# Altium project Control_Board_Model_C201.PrjPcb (part 1 of 8)
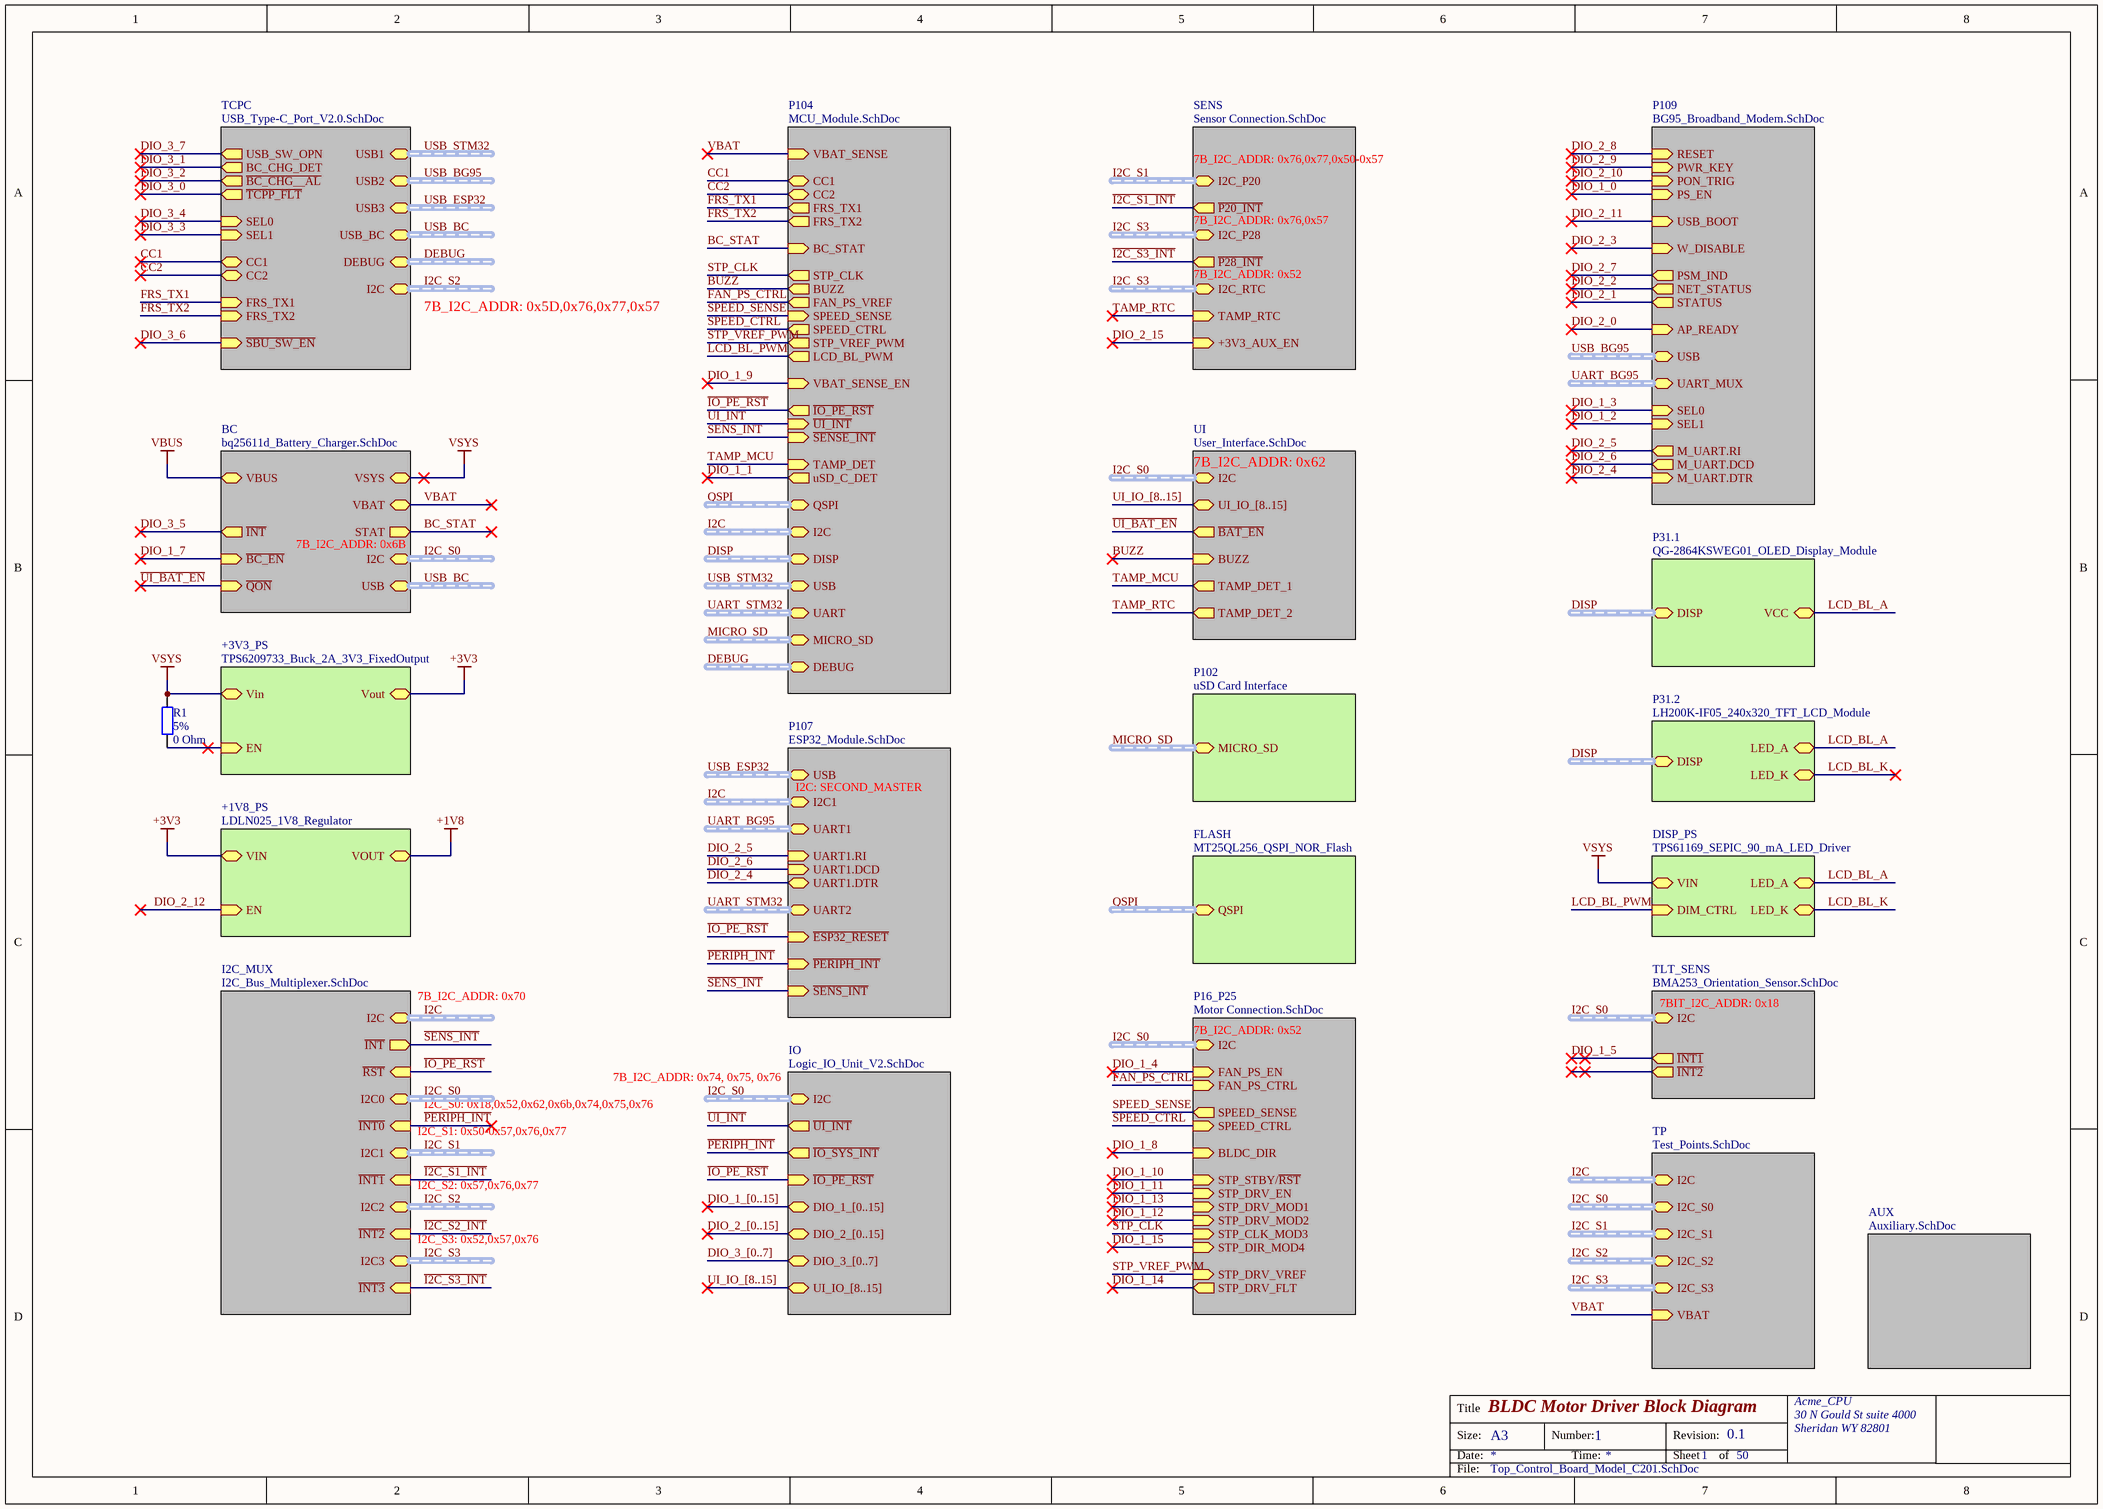
[diagram p0: Top_Control_Board_Model_C201.SchDoc]
_Title: Control_Board; _Revision: 0.1; _PCBNumber: 001; _PCBModel: C201; _HWEngineer: SGU; _DocumentDate: 20211204; _DateCode: 2020.30; _CompanyName: Acme_CPU; _BoardName: Control_Board; _ApprovedBy: PGU; _address2: Sheridan WY 82801; _address1: 30 N Gould St suite 4000
21 sheets, 279 parts. Net scope: hierarchical (ports join the sheet entries above them; power ports are global).
Board file: Control_Board_Model_C201_FFC_Sens_Conn.PcbDoc
Sheets:
  Top_Control_Board_Model_C201.SchDoc
    TCPC = USB_Type-C_Port_V2.0.SchDoc
    TP = Test_Points.SchDoc
    P104 = MCU_Module.SchDoc
      P01 = SWD_TagConnect.SchDoc
      RTC_XTAL = NX3215SA-32.768k_Crystall_Oscillator.SchDoc
      AN_IO = Analog_Signal_Conditioner_V2.SchDoc
    P16_P25 = Motor Connection.SchDoc
    SENS = Sensor Connection.SchDoc
    BC = bq25611d_Battery_Charger.SchDoc
    UI = User_Interface.SchDoc
    AUX = Auxiliary.SchDoc
    P107 = ESP32_Module.SchDoc
    P109 = BG95_Broadband_Modem.SchDoc
      BG95_MISC = BG95_Misc.SchDoc
      BG95_PWR = BG95_Power.SchDoc
      BG95_RF = BG95_RF.SchDoc
      BG95_VLT = BG95_VLT.SchDoc
    IO = Logic_IO_Unit_V2.SchDoc
    I2C_MUX = I2C_Bus_Multiplexer.SchDoc
    TLT_SENS = BMA253_Orientation_Sensor.SchDoc

## Sheet Top_Control_Board_Model_C201.SchDoc: BLDC Motor Driver Block Diagram
size A3; DocumentNumber: 1; SheetNumber: 1; SheetTotal: 50

### Parts
R1  Tolerance: 5%  Resistance: 0 Ohm  [R0402]  (hidden comment: RES SMD 0 OHM JUMPER 1/16W 0402)

### Sub-sheets
+1V8_PS = LDLN025_1V8_Regulator (file not in this document): EN (in), VIN, VOUT
+3V3_PS = TPS6209733_Buck_2A_3V3_FixedOutput (file not in this document): Vout, Vin, EN (in)
AUX = Auxiliary.SchDoc: no entries
BC = bq25611d_Battery_Charger.SchDoc: VSYS, VBUS, ~{QON} (in), USB (harness USB), I2C (harness I2C), ~{INT} (out), STAT (out), ~{BC_EN} (in), VBAT  | 7B_I2C_ADDR: 0x6B
DISP_PS = TPS61169_SEPIC_90_mA_LED_Driver (file not in this document): VIN, LED_K, DIM_CTRL (in), LED_A
FLASH = MT25QL256_QSPI_NOR_Flash (file not in this document): QSPI (harness QSPI)
I2C_MUX = I2C_Bus_Multiplexer.SchDoc: I2C0 (harness I2C), I2C1 (harness I2C), I2C2 (harness I2C), I2C3 (harness I2C), ~{INT0} (in), ~{INT1} (in), ~{INT2} (in), ~{INT3} (in), I2C (harness I2C), ~{INT} (out), ~{RST} (in)  | 7B_I2C_ADDR: 0x70; I2C_S0: 0x18,0x52,0x62,0x6b,0x74,0x75,0x76; I2C_S1: 0x50-0x57,0x76,0x77; I2C_S2: 0x57,0x76,0x77; I2C_S3: 0x52,0x57,0x76
IO = Logic_IO_Unit_V2.SchDoc: I2C (harness I2C), DIO_1_[0..15] (bidir), ~{IO_PE_RST} (in), DIO_2_[0..15] (bidir), DIO_3_[0..7] (bidir), UI_IO_[8..15] (bidir), ~{IO_SYS_INT} (out), ~{UI_INT} (out)  | 7B_I2C_ADDR: 0x74, 0x75, 0x76
P16_P25 = Motor Connection.SchDoc: SPEED_CTRL (in), SPEED_SENSE (out), FAN_PS_CTRL (in), BLDC_DIR (in), I2C (harness I2C), STP_STBY/~{RST} (in), STP_DRV_EN (in), STP_DRV_MOD1 (in), STP_DRV_MOD2 (in), STP_CLK_MOD3 (in), STP_DIR_MOD4 (in), STP_DRV_VREF (in), STP_DRV_FLT (out), FAN_PS_EN (in)  | 7B_I2C_ADDR: 0x52
P31.1 = QG-2864KSWEG01_OLED_Display_Module (file not in this document): DISP (harness DISP_SPI), VCC
P31.2 = LH200K-IF05_240x320_TFT_LCD_Module (file not in this document): DISP (harness DISP_SPI), LED_K, LED_A
P102 = uSD Card Interface (file not in this document): MICRO_SD (harness MICRO_SD)
P104 = MCU_Module.SchDoc: FAN_PS_VREF (out), SPEED_CTRL (out), SPEED_SENSE (in), CC2 (bidir), CC1 (bidir), I2C (harness I2C), BC_STAT (in), BUZZ (out), VBAT_SENSE (in), MICRO_SD (harness MICRO_SD), DISP (harness DISP_SPI), USB (harness USB), ~{IO_PE_RST} (out), STP_CLK (out), STP_VREF_PWM (out), LCD_BL_PWM (out), QSPI (harness QSPI), UART (harness UART), FRS_TX1 (out), FRS_TX2 (out), ~{UI_INT} (in), TAMP_DET (in), ~{SENSE_INT} (in), DEBUG (harness DEBUG), uSD_C_DET (out), VBAT_SENSE_EN (in)
P107 = ESP32_Module.SchDoc: ~{ESP32_RESET} (in), UART2 (harness UART), USB (harness USB), UART1 (harness UART), I2C1 (harness I2C), UART1.RI (in), UART1.DCD (in), UART1.DTR (bidir), ~{PERIPH_INT} (in), ~{SENS_INT} (in)  | I2C: SECOND_MASTER
P109 = BG95_Broadband_Modem.SchDoc: PWR_KEY (in), PON_TRIG (in), W_DISABLE (in), USB_BOOT (in), NET_STATUS (out), AP_READY (in), STATUS (out), PSM_IND (out), PS_EN (in), RESET (in), USB (harness USB), SEL1 (in), SEL0 (in), UART_MUX (harness UART), M_UART.RI (out), M_UART.DCD (out), M_UART.DTR (in)
SENS = Sensor Connection.SchDoc: ~{P20_INT} (out), I2C_P20 (harness I2C), I2C_P28 (harness I2C), ~{P28_INT} (out), +3V3_AUX_EN (in), I2C_RTC (harness I2C), TAMP_RTC (in)  | 7B_I2C_ADDR: 0x76,0x77,0x50-0x57; 7B_I2C_ADDR: 0x76,0x57; 7B_I2C_ADDR: 0x52
TCPC = USB_Type-C_Port_V2.0.SchDoc: CC1 (bidir), CC2 (bidir), USB1 (harness USB), USB2 (harness USB), SEL1 (in), SEL0 (in), BC_CHG_DET (out), USB_SW_OPN (out), ~{TCPP_FLT} (out), USB3 (harness USB), ~{BC_CHG__AL} (out), USB_BC (harness USB), FRS_TX1 (in), FRS_TX2 (in), I2C (harness I2C), ~{SBU_SW_EN} (in), DEBUG (harness DEBUG)  | 7B_I2C_ADDR: 0x5D,0x76,0x77,0x57
TLT_SENS = BMA253_Orientation_Sensor.SchDoc: ~{INT2} (out), ~{INT1} (out), I2C (harness I2C)  | 7BIT_I2C_ADDR: 0x18
TP = Test_Points.SchDoc: I2C (harness I2C), I2C_S0 (harness I2C), I2C_S1 (harness I2C), I2C_S2 (harness I2C), I2C_S3 (harness I2C), VBAT (in)
UI = User_Interface.SchDoc: ~{BAT_EN} (out), BUZZ (in), TAMP_DET_1 (out), UI_IO_[8..15] (bidir), TAMP_DET_2 (out), I2C (harness I2C)  | 7B_I2C_ADDR: 0x62

### Nets
+3V3: sheet +3V3_PS/Vout, sheet +1V8_PS/VIN
VSYS: R1.2 ; sheet BC/VSYS, sheet +3V3_PS/Vin, sheet DISP_PS/VIN
~{I2C_S1_INT}: sheet SENS/~{P20_INT}, sheet I2C_MUX/~{INT1}
~{I2C_S3_INT}: sheet SENS/~{P28_INT}, sheet I2C_MUX/~{INT3}
~{IO_PE_RST}: sheet P104/~{IO_PE_RST}, sheet P107/~{ESP32_RESET}, sheet IO/~{IO_PE_RST}, sheet I2C_MUX/~{RST}
~{PERIPH_INT}: sheet P107/~{PERIPH_INT}, sheet IO/~{IO_SYS_INT}, sheet I2C_MUX/~{INT0}  [project net ~{INT0}]
~{SENS_INT}: sheet P104/~{SENSE_INT}, sheet P107/~{SENS_INT}, sheet I2C_MUX/~{INT}
~{UI_BAT_EN}: sheet BC/~{QON}, sheet UI/~{BAT_EN}
~{UI_INT}: sheet P104/~{UI_INT}, sheet IO/~{UI_INT}  [project net ~{IO_SYS_INT}]
BC_STAT: sheet P104/BC_STAT, sheet BC/STAT
BUZZ: sheet P104/BUZZ, sheet UI/BUZZ
CC1: sheet TCPC/CC1, sheet P104/CC1
CC2: sheet TCPC/CC2, sheet P104/CC2
DIO_1_0: sheet P109/PS_EN
DIO_1_1: sheet P104/uSD_C_DET
DIO_1_4: sheet P16_P25/FAN_PS_EN
DIO_1_5: sheet TLT_SENS/~{INT1}
DIO_1_10: sheet P16_P25/STP_STBY/~{RST}
DIO_1_11: sheet P16_P25/STP_DRV_EN
DIO_1_12: sheet P16_P25/STP_DRV_MOD2
DIO_1_13: sheet P16_P25/STP_DRV_MOD1
DIO_1_14: sheet P16_P25/STP_DRV_FLT
DIO_1_15: sheet P16_P25/STP_DIR_MOD4
DIO_2_0: sheet P109/AP_READY  [project net B1_0]
DIO_2_1: sheet P109/STATUS  [project net B1_1]
DIO_2_2: sheet P109/NET_STATUS  [project net B1_2]
DIO_2_3: sheet P109/W_DISABLE  [project net B1_3]
DIO_2_4: sheet P107/UART1.DTR, sheet P109/M_UART.DTR  [project net B1_4]
DIO_2_5: sheet P107/UART1.RI, sheet P109/M_UART.RI  [project net B1_5]
DIO_2_6: sheet P107/UART1.DCD, sheet P109/M_UART.DCD  [project net B1_6]
DIO_2_7: sheet P109/PSM_IND  [project net B1_7]
DIO_2_12: sheet +1V8_PS/EN
DIO_2_15: sheet SENS/+3V3_AUX_EN  [project net +3V3_AUX_EN]
DIO_3_0: sheet TCPC/~{TCPP_FLT}
DIO_3_2: sheet TCPC/~{BC_CHG__AL}
DIO_3_7: sheet TCPC/USB_SW_OPN
FAN_PS_CTRL: sheet P104/FAN_PS_VREF, sheet P16_P25/FAN_PS_CTRL
FRS_TX1: sheet TCPC/FRS_TX1, sheet P104/FRS_TX1
FRS_TX2: sheet TCPC/FRS_TX2, sheet P104/FRS_TX2
LCD_BL_A: sheet P31.1/VCC, sheet DISP_PS/LED_A, sheet P31.2/LED_A
LCD_BL_K: sheet DISP_PS/LED_K, sheet P31.2/LED_K
LCD_BL_PWM: sheet P104/LCD_BL_PWM, sheet DISP_PS/DIM_CTRL
SPEED_CTRL: sheet P104/SPEED_CTRL, sheet P16_P25/SPEED_CTRL  [project net PA1]
SPEED_SENSE: sheet P104/SPEED_SENSE, sheet P16_P25/SPEED_SENSE  [project net PA15]
STP_CLK: sheet P104/STP_CLK, sheet P16_P25/STP_CLK_MOD3  [project net PB9]
STP_VREF_PWM: sheet P104/STP_VREF_PWM, sheet P16_P25/STP_DRV_VREF  [project net PC7]
TAMP_MCU: sheet P104/TAMP_DET, sheet UI/TAMP_DET_1  [project net PC13]
TAMP_RTC: sheet SENS/TAMP_RTC, sheet UI/TAMP_DET_2
VBAT: sheet TP/VBAT, sheet P104/VBAT_SENSE, sheet BC/VBAT
NetR1_1: R1.1 ; sheet +3V3_PS/EN

### Buses and harness runs
bus DIO_1_[0..15] = sheet IO/DIO_1_[0..15]
bus DIO_2_[0..15] = sheet IO/DIO_2_[0..15]
bus DIO_3_[0..7] = sheet IO/DIO_3_[0..7]
bus UI_IO_[8..15] = sheet IO/UI_IO_[8..15]
bus UI_IO_[8..15] = sheet UI/UI_IO_[8..15]
harness DEBUG = sheet P104/DEBUG
harness DEBUG = sheet TCPC/DEBUG
harness DISP = sheet P31.1/DISP
harness DISP = sheet P31.2/DISP
harness DISP = sheet P104/DISP
harness I2C = sheet I2C_MUX/I2C
harness I2C = sheet P104/I2C
harness I2C = sheet P107/I2C1
harness I2C = sheet TP/I2C
harness I2C_S0 = sheet BC/I2C
harness I2C_S0 = sheet I2C_MUX/I2C0
harness I2C_S0 = sheet IO/I2C
harness I2C_S0 = sheet P16_P25/I2C
harness I2C_S0 = sheet TLT_SENS/I2C
harness I2C_S0 = sheet TP/I2C_S0
harness I2C_S0 = sheet UI/I2C
harness I2C_S1 = sheet I2C_MUX/I2C1
harness I2C_S1 = sheet SENS/I2C_P20
harness I2C_S1 = sheet TP/I2C_S1
harness I2C_S2 = sheet I2C_MUX/I2C2
harness I2C_S2 = sheet TCPC/I2C
harness I2C_S2 = sheet TP/I2C_S2
harness I2C_S3 = sheet I2C_MUX/I2C3
harness I2C_S3 = sheet SENS/I2C_P28
harness I2C_S3 = sheet SENS/I2C_RTC
harness I2C_S3 = sheet TP/I2C_S3
harness MICRO_SD = sheet P102/MICRO_SD
harness MICRO_SD = sheet P104/MICRO_SD
harness QSPI = sheet FLASH/QSPI
harness QSPI = sheet P104/QSPI
harness UART_BG95 = sheet P107/UART1
harness UART_BG95 = sheet P109/UART_MUX
harness UART_STM32 = sheet P104/UART
harness UART_STM32 = sheet P107/UART2
harness USB_BC = sheet BC/USB
harness USB_BC = sheet TCPC/USB_BC
harness USB_BG95 = sheet P109/USB
harness USB_BG95 = sheet TCPC/USB2
harness USB_ESP32 = sheet P107/USB
harness USB_ESP32 = sheet TCPC/USB3
harness USB_STM32 = sheet P104/USB
harness USB_STM32 = sheet TCPC/USB1

### Notes on the sheet
- Title
- Size:
- Date:
- A3
- Number:
- Time:
- Revision:
- Sheet
- of
- File:

### Library data of the parts
R1 = RES SMD 0 OHM JUMPER 1/16W 0402: 0 Ohms Jumper 0.063W, 1/16W Chip Resistor 0402 (1005 Metric) Moisture Resistant Thick Film; Manufacturer: Yageo; Manufacturer Part Number: RC0402JR-070RL; Power Rating: 62.5mW; Voltage Rating: 50V; Max Power Dissipation: 63mW; Temperature Coefficient: 200ppm/°C; Supplier 1: Digi-Key; Stock 1: 46057148; Pricing 1: 1=0.1, 10=0.013, 25=0.0092, 50=0.0072, 100=0.0053, 250=0.004, 500=0.0032, 1000=0.0024, 5000=0.0017 (USD); Contact Plating: Tin,Matte; Case Code (Metric): 1005; Case Code (Imperial): 0402; Min Operating Temperature: -55°C; Max Operating Temperature: 155°C; Packaging: Tape and Reel; Composition: Thick Film; Package Quantity: 1; Number of Terminations: 2; Termination: SMD/SMT; Military Standard: Not; Features: Moisture Resistant; Length: 1mm; Height: 0.016inch; Width: 0.02inch; Depth: 0.5mm; Radiation Hardening: No; REACH SVHC: Unknown; Lead Free: Lead Free; ComponentLink1URL: http://www.yageo.com/documents/recent/PYu-RC_Group_51_RoHS_L_10.pdf?src-supplier=Digi-Key; ComponentLink1Description: http://www.yageo.com/documents/recent/PYu-RC_Group_51_RoHS_L_10.pdf?src-supplier=Digi-Key; ComponentLink2URL: http://www.yageo.com/documents/recent/PYu-RC0402_51_RoHS_L_6.pdf?src-supplier=Avnet+Europe; ComponentLink2Description: http://www.yageo.com/documents/recent/PYu-RC0402_51_RoHS_L_6.pdf?src-supplier=Avnet+Europe; ComponentLink3URL: http://www.farnell.com/datasheets/1018594.pdf?src-supplier=Element14; ComponentLink3Description: http://www.farnell.com/datasheets/1018594.pdf?src-supplier=Element14; ComponentLink4URL: https://www.verical.com/server-webapp/html/getDatasheet?partID=326379&src-supplier=Verical; ComponentLink4Description: https://www.verical.com/server-webapp/html/getDatasheet?partID=326379&src-supplier=Verical; ComponentLink5URL: http://www.farnell.com/datasheets/2167052.pdf?src-supplier=Element14; ComponentLink5Description: http://www.farnell.com/datasheets/2167052.pdf?src-supplier=Element14; Supplier Part Number 1: 311-0.0JRCT-ND; Case/Package: 0402; ClassName: +3V3_PS; Mount: Surface Mount

## Sheet USB_Type-C_Port_V2.0.SchDoc: USB Type-C PD Port Controller
size A4; DocumentNumber: 2; SheetNumber: 2; SheetTotal: 50
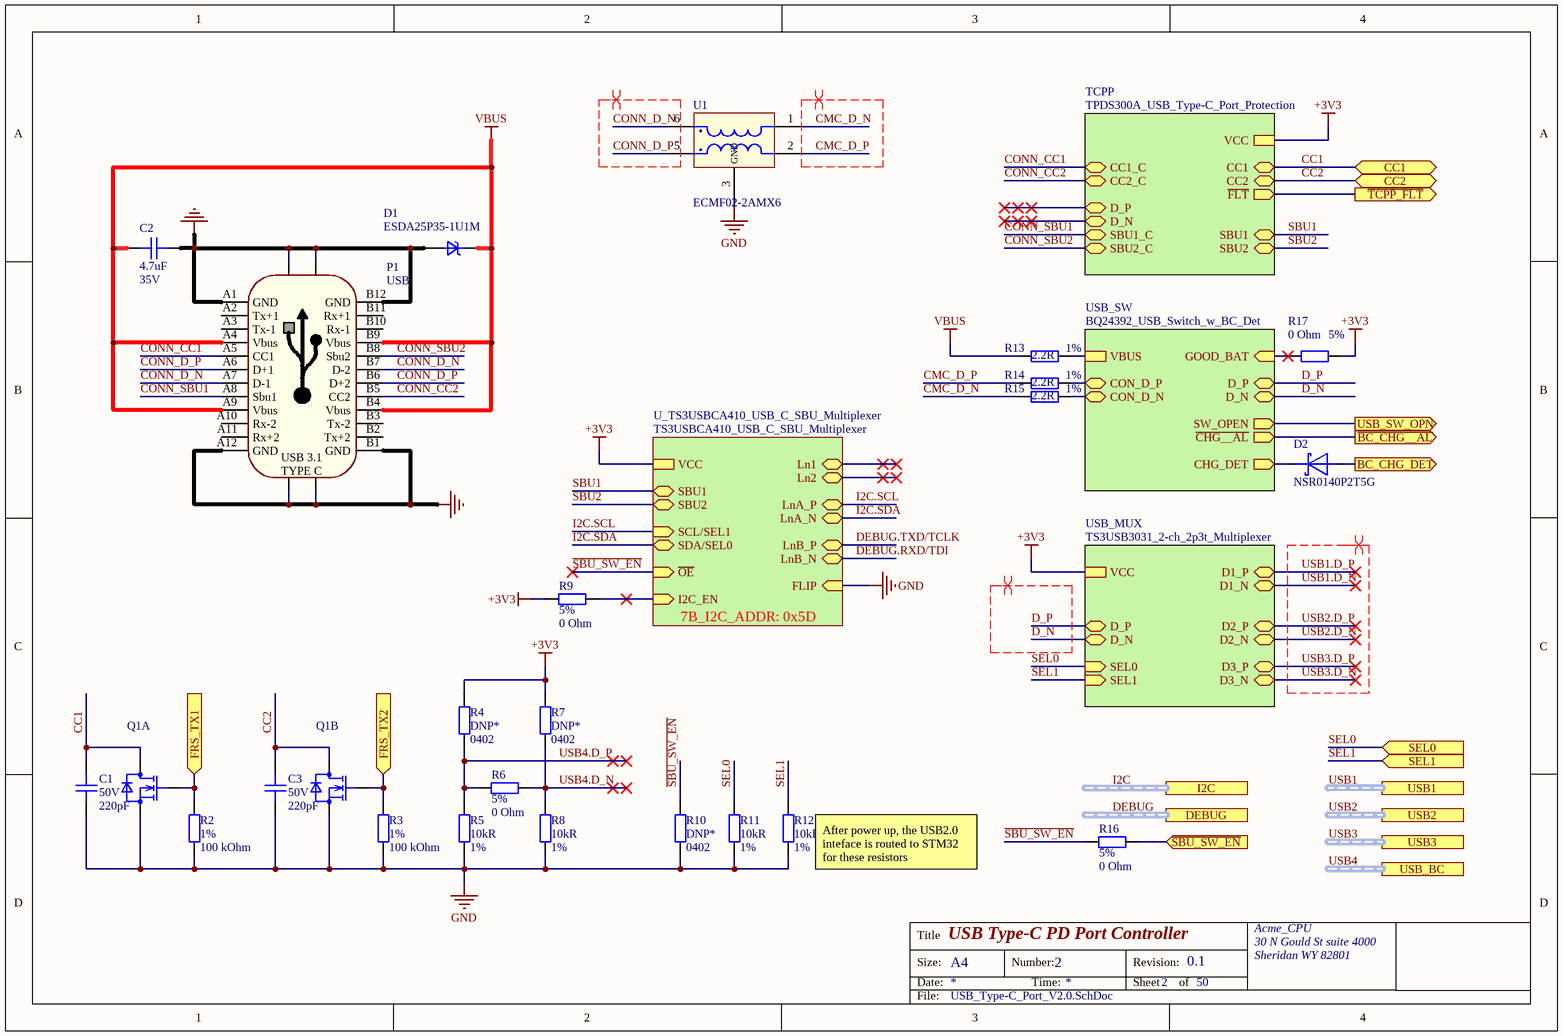
[diagram p1: USB_Type-C_Port_V2.0.SchDoc]

### Parts
C1  Voltage Rating: 50V  Capacitance: 220pF  [C0402]  (hidden comment: CAP CER 220PF 50V X7R 0402)
C2  Capacitance: 4.7uF  Voltage Rating: 35V  [C0805]  (hidden comment: CAP CER 4.7UF 35V X7R 0805)
C3  Voltage Rating: 50V  Capacitance: 220pF  [C0402]  (hidden comment: CAP CER 220PF 50V X7R 0402)
D1  ESDA25P35-1U1M  [ST_QFN_1610]
D2  NSR0140P2T5G  [SODFL100X40-2N]
P1  USB  [MOLEX_2012670005]
Q1  DMN32D2LV-7  [SON_400UV-7_DIO]  (value not drawn)  (parts A,B of 2)
R2  Tolerance: 1%  Resistance: 100 kOhm  [R0402]  (hidden comment: RES SMD 100K OHM 1% 1/16W 0402)
R3  Tolerance: 1%  Resistance: 100 kOhm  [R0402]  (hidden comment: RES SMD 100K OHM 1% 1/16W 0402)
R4  DNP*  Case/Package: 0402  [R0402]  (no BOM)
R5  Resistance: 10kR  Tolerance: 1%  [R0402]  (hidden comment: RES SMD 10K OHM 1% 1/16W 0402)
R6  Tolerance: 5%  Resistance: 0 Ohm  [R0402]  (hidden comment: RES SMD 0 OHM JUMPER 1/16W 0402)
R7  DNP*  Case/Package: 0402  [R0402]  (no BOM)
R8  Resistance: 10kR  Tolerance: 1%  [R0402]  (hidden comment: RES SMD 10K OHM 1% 1/16W 0402)
R9  Tolerance: 5%  Resistance: 0 Ohm  [R0402]  (hidden comment: RES SMD 0 OHM JUMPER 1/16W 0402)
R10  DNP*  Case/Package: 0402  [R0402]  (no BOM)
R11  Resistance: 10kR  Tolerance: 1%  [R0402]  (hidden comment: RES SMD 10K OHM 1% 1/16W 0402)
R12  Resistance: 10kR  Tolerance: 1%  [R0402]  (hidden comment: RES SMD 10K OHM 1% 1/16W 0402)
R13  Tolerance: 1%  Resistance: 2.2R  [R0402]  (hidden comment: RES SMD 2.2 OHM 1% 1/16W 0402)
R14  Tolerance: 1%  Resistance: 2.2R  [R0402]  (hidden comment: RES SMD 2.2 OHM 1% 1/16W 0402)
R15  Tolerance: 1%  Resistance: 2.2R  [R0402]  (hidden comment: RES SMD 2.2 OHM 1% 1/16W 0402)
R16  Tolerance: 5%  Resistance: 0 Ohm  [R0402]  (hidden comment: RES SMD 0 OHM JUMPER 1/16W 0402)
R17  Tolerance: 5%  Resistance: 0 Ohm  [R0402]  (hidden comment: RES SMD 0 OHM JUMPER 1/16W 0402)
U1  ECMF02-2AMX6  [QFN-6L]

### Sub-sheets
TCPP = TPDS300A_USB_Type-C_Port_Protection (file not in this document): ~{FLT} (out), VCC, CC1 (bidir), CC2 (bidir), CC1_C (bidir), CC2_C (bidir), SBU1_C (bidir), SBU2_C (bidir), SBU1 (bidir), SBU2 (bidir), D_P (bidir), D_N (bidir)
U_TS3USBCA410_USB_C_SBU_Multiplexer = TS3USBCA410_USB_C_SBU_Multiplexer (file not in this document): LnB_P (bidir), LnB_N (bidir), LnA_P (bidir), VCC, Ln1 (bidir), Ln2 (bidir), SBU1 (bidir), SBU2 (bidir), LnA_N (bidir), SCL/SEL1 (in), I2C_EN (in), FLIP (in), SDA/SEL0 (bidir), ~{OE} (in)  | 7B_I2C_ADDR: 0x5D
USB_MUX = TS3USB3031_2-ch_2p3t_Multiplexer (file not in this document): VCC, D_P (bidir), D_N (bidir), D1_N (bidir), D1_P (bidir), D2_P (bidir), D2_N (bidir), D3_N (bidir), D3_P (bidir), SEL0 (in), SEL1 (in)
USB_SW = BQ24392_USB_Switch_w_BC_Det (file not in this document): CHG_DET (out), D_N (bidir), D_P (bidir), GOOD_BAT (in), CON_D_N (bidir), CON_D_P (bidir), SW_OPEN (out), VBUS, ~{CHG__AL} (out)

### Ports
BC_CHG_DET (out), CC1 (bidir), CC2 (bidir), DEBUG (harness DEBUG), FRS_TX1 (in), FRS_TX2 (in), I2C (harness I2C), SEL0 (in), SEL1 (in), USB1 (harness USB), USB2 (harness USB), USB3 (harness USB), USB_BC (harness USB), USB_SW_OPN (out), ~{BC_CHG__AL} (out), ~{SBU_SW_EN} (in), ~{TCPP_FLT} (out)

### Nets
+3V3: R4.1 R7.1 R9.1 R17.2 ; sheet USB_MUX/VCC, sheet TCPP/VCC, sheet U_TS3USBCA410_USB_C_SBU_Multiplexer/VCC
GND: C1.1 C2.2 C3.1 D1.2(A) P1.A1(GND) P1.A12(GND) P1.B1(GND) P1.B12(GND) P1.S1 P1.S2 P1.S3 P1.S4 Q1.1(S) Q1.4(S) R2.1 R3.1 R5.2 R8.2 R10.2 R11.2 R12.2 U1.3(GND) ; sheet U_TS3USBCA410_USB_C_SBU_Multiplexer/FLIP
VBUS: C2.1 D1.1(K) P1.A4(Vbus) P1.A9(Vbus) P1.B4(Vbus) P1.B9(Vbus) R13.1
~{SBU_SW_EN}: R10.1 R16.2 ; sheet U_TS3USBCA410_USB_C_SBU_Multiplexer/~{OE}
CC1: C1.2 Q1.6(D) ; port CC1, sheet TCPP/CC1
CC2: C3.2 Q1.3(D) ; port CC2, sheet TCPP/CC2
CMC_D_N: R15.1 U1.1(INP1)
CMC_D_P: R14.1 U1.2(INP2)
CONN_CC1: P1.A5(CC1) ; sheet TCPP/CC1_C
CONN_CC2: P1.B5(CC2) ; sheet TCPP/CC2_C
CONN_D_N: P1.A7(D-1) P1.B7(D-2) U1.6(OUT1)
CONN_D_P: P1.A6(D+1) P1.B6(D+2) U1.5(OUT2)
CONN_SBU1: P1.A8(Sbu1) ; sheet TCPP/SBU1_C
CONN_SBU2: P1.B8(Sbu2) ; sheet TCPP/SBU2_C
D_N: sheet USB_MUX/D_N, sheet USB_SW/D_N
D_P: sheet USB_MUX/D_P, sheet USB_SW/D_P
DEBUG.RXD/TDI: sheet U_TS3USBCA410_USB_C_SBU_Multiplexer/LnB_N
DEBUG.TXD/TCLK: sheet U_TS3USBCA410_USB_C_SBU_Multiplexer/LnB_P
DIO_3_0: port ~{TCPP_FLT}, sheet TCPP/~{FLT}
DIO_3_1: D2.2(A) ; port BC_CHG_DET
DIO_3_2: port ~{BC_CHG__AL}, sheet USB_SW/~{CHG__AL}
DIO_3_6: R16.1 ; port ~{SBU_SW_EN}
DIO_3_7: port USB_SW_OPN, sheet USB_SW/SW_OPEN
FRS_TX1: Q1.2(G) R2.2 ; port FRS_TX1
FRS_TX2: Q1.5(G) R3.2 ; port FRS_TX2
I2C.SCL: sheet U_TS3USBCA410_USB_C_SBU_Multiplexer/LnA_P, sheet U_TS3USBCA410_USB_C_SBU_Multiplexer/SCL/SEL1
I2C.SDA: sheet U_TS3USBCA410_USB_C_SBU_Multiplexer/LnA_N, sheet U_TS3USBCA410_USB_C_SBU_Multiplexer/SDA/SEL0
SBU1: sheet TCPP/SBU1, sheet U_TS3USBCA410_USB_C_SBU_Multiplexer/SBU1
SBU2: sheet TCPP/SBU2, sheet U_TS3USBCA410_USB_C_SBU_Multiplexer/SBU2
SEL0: R11.1 ; port SEL0, sheet USB_MUX/SEL0  [project net DIO_3_4]
SEL1: R12.1 ; port SEL1, sheet USB_MUX/SEL1  [project net DIO_3_3]
USB1.D_N: sheet USB_MUX/D1_N
USB1.D_P: sheet USB_MUX/D1_P
USB2.D_N: sheet USB_MUX/D2_N
USB2.D_P: sheet USB_MUX/D2_P
USB3.D_N: sheet USB_MUX/D3_N
USB3.D_P: sheet USB_MUX/D3_P
USB4.D_N: R6.2 R7.2 R8.1
USB4.D_P: R4.2 R5.1 R6.1
NetD2_1: D2.1(K) ; sheet USB_SW/CHG_DET
NetR9_2: R9.2 ; sheet U_TS3USBCA410_USB_C_SBU_Multiplexer/I2C_EN
NetR13_2: R13.2 ; sheet USB_SW/VBUS
NetR14_2: R14.2 ; sheet USB_SW/CON_D_P
NetR15_2: R15.2 ; sheet USB_SW/CON_D_N
NetR17_1: R17.1 ; sheet USB_SW/GOOD_BAT

Not connected (* = marked no-connect by the designer): P1 A2(Tx+1) A3(Tx-1) A10(Rx-2) A11(Rx+2) B2(Tx+2) B3(Tx-2) B10(Rx-1) B11(Rx+1); U1 4(NC)

### Buses and harness runs
harness DEBUG = port DEBUG
harness I2C = port I2C
harness USB1 = port USB1
harness USB2 = port USB2
harness USB3 = port USB3
harness USB4 = port USB_BC

### Layout directives
differential pair: CMC_D_N, CMC_D_P, CONN_D_N, CONN_D_P, D_N, D_P, USB1.D_N, USB1.D_P, USB2.D_N, USB2.D_P, USB3.D_N, USB3.D_P

### Notes on the sheet
- (near R12) After power up, the USB2.0 inteface is routed to STM32 for these resistors
- Title
- Size:
- Date:
- A4
- Number:
- Time:
- Revision:
- Sheet
- of
- File:
- (in symbol CONN 2012670005 RCP USB3.1 TYPEC 24P SMD RA) USB 3.1; TYPE C

### Library data of the parts
C1 C3 = CAP CER 220PF 50V X7R 0402: 220pF ±10% 50V Ceramic Capacitor X7R 0402 (1005 Metric); Manufacturer: Yageo; Manufacturer Part Number: CC0402KRX7R9BB221; Insulation Resistance: 100GR; Supplier 1: Digi-Key; Stock 1: 91221; Pricing 1: 1=0.1, 10=0.026, 50=0.014, 100=0.0114, 500=0.0081, 1000=0.0064, 2500=0.0058, 5000=0.0053 (USD); Mount: Surface Mount; Case/Package: 0402; Weight: 2.3E-05oz; Case Code (Metric): 1005; Case Code (Imperial): 0402; Min Operating Temperature: -55°C; Max Operating Temperature: 125°C; Tolerance: 10%; Packaging: Tape and Reel; Package Quantity: 1; Voltage Rating (DC): 50V; Dielectric: X7R; Termination: SMD/SMT; Composition: Ceramic; Length: 1mm; Height: 0.5mm; Width: 0.02inch; Thickness: 0.022inch; Depth: 0.5mm; REACH SVHC: No SVHC; Lead Free: Lead Free; ComponentLink1URL: http://www.yageo.com/documents/recent/UPY-GPHC_X7R_6.3V-to-50V_18.pdf?src-supplier=Digi-Key; ComponentLink1Description: http://www.yageo.com/documents/recent/UPY-GPHC_X7R_6.3V-to-50V_18.pdf?src-supplier=Digi-Key; ComponentLink2URL: http://www.farnell.com/datasheets/2167236.pdf?src-supplier=Farnell; ComponentLink2Description: http://www.farnell.com/datasheets/2167236.pdf?src-supplier=Farnell; ComponentLink3URL: http://www.yageo.com/documents/recent/UPY-GPHC_X7R_6.3V-to-50V_8.pdf?src-supplier=Avnet; ComponentLink3Description: http://www.yageo.com/documents/recent/UPY-GPHC_X7R_6.3V-to-50V_8.pdf?src-supplier=Avnet; ComponentLink4URL: http://www.farnell.com/datasheets/1489800.pdf?src-supplier=Element14; ComponentLink4Description: http://www.farnell.com/datasheets/1489800.pdf?src-supplier=Element14; ComponentLink5URL: http://www.mouser.com/ds/2/447/Yageo_UPY-GP_NP0_16V-to-50V_9-358835.pdf?src-supplier=Mouser; ComponentLink5Description: http://www.mouser.com/ds/2/447/Yageo_UPY-GP_NP0_16V-to-50V_9-358835.pdf?src-supplier=Mouser; Supplier Part Number 1: 311-1035-1-ND; Number of Pins: 2; Dielectric Material: Ceramic; Radiation Hardening: No; Halogen Free: Halogen Free; ComponentLink6URL: https://www.verical.com/server-webapp/html/getDatasheet?partID=403476&src-supplier=Verical; ComponentLink6Description: https://www.verical.com/server-webapp/html/getDatasheet?partID=403476&src-supplier=Verical; ComponentLink7URL: http://www.yageo.com/documents/recent/UPY-GPHC_X7R_6.3V-to-50V_8.pdf?src-supplier=Avnet+Europe; ComponentLink7Description: http://www.yageo.com/documents/recent/UPY-GPHC_X7R_6.3V-to-50V_8.pdf?src-supplier=Avnet+Europe; ClassName: TCPP
C2 = CAP CER 4.7UF 35V X7R 0805: Manufacturer: TDK; Manufacturer Part Number: C2012X7R1V475K125AC; Dielectric Material: Ceramic; Tolerance: 10%; Supplier 1: Digi-Key; Stock 1: 109602; Pricing 1: 1=0.73, 10=0.519, 50=0.3752, 100=0.3416, 500=0.253, 1000=0.2151 (USD); Mount: Surface Mount; Case/Package: 0805; Weight: 0.000194oz; Case Code (Metric): 2012; Case Code (Imperial): 0805; Min Operating Temperature: -55°C; Max Operating Temperature: 125°C; Packaging: Tape and Reel; Package Quantity: 2000; Dielectric: X7R; Termination: SMD/SMT; Voltage Rating (DC): 35V; Length: 2mm; Height: 1.25mm; Width: 0.049inch; Thickness: 0.057inch; Depth: 1.25mm; Radiation Hardening: No; REACH SVHC: No SVHC; Lead Free: Lead Free; ComponentLink1URL: http://www.farnell.com/datasheets/2792994.pdf?src-supplier=Element14; ComponentLink1Description: http://www.farnell.com/datasheets/2792994.pdf?src-supplier=Element14; ComponentLink2URL: https://product.tdk.com/info/en/catalog/datasheets/mlcc_commercial_general_en.pdf?src-supplier=Digi-Key; ComponentLink2Description: https://product.tdk.com/info/en/catalog/datasheets/mlcc_commercial_general_en.pdf?src-supplier=Digi-Key; ComponentLink3URL: https://product.tdk.com/info/en/catalog/spec/mlccspec_commercial_general_midvoltage_en.pdf?src-supplier=Digi-Key; ComponentLink3Description: https://product.tdk.com/info/en/catalog/spec/mlccspec_commercial_general_midvoltage_en.pdf?src-supplier=Digi-Key; Supplier Part Number 1: 445-7555-1-ND
D1 = TVS DIODE ESDA25P35-1U1M 22V 41V 1610: 41V Clamp 35A (8/20µs) Ipp Tvs Diode Surface Mount 1610; Manufacturer: STMicroelectronics; Number of Unidirectional Channels: 1; Reverse Standoff Voltage: 22V; Min Breakdown Voltage: 23.3V; Peak Pulse Power: 1.4kW; Power Line Protection: No; Supplier 1: Digi-Key; Manufacturer Part Number: ESDA25P35-1U1M; Stock 1: 12413; Pricing 1: 1=0.45, 10=0.362, 25=0.3312, 100=0.2079, 250=0.2056, 500=0.1925, 1000=0.1309, 2500=0.1255 (USD); Mount: Surface Mount; Case/Package: 1610; Number of Pins: 2; Min Operating Temperature: -55°C; Max Operating Temperature: 150°C; Composition: Zener; Packaging: Tape and Reel; Clamping Voltage: 41V; Peak Pulse Current: 35A; ComponentLink1URL: http://www.st.com/content/ccc/resource/technical/document/datasheet/group3/e4/43/53/b9/4e/8a/40/bb/DM00312034/files/DM00312034.pdf/jcr:content/translations/en.DM00312034.pdf?src-supplier=Digi-Key; ComponentLink1Description: http://www.st.com/content/ccc/resource/technical/document/datasheet/group3/e4/43/53/b9/4e/8a/40/bb/DM00312034/files/DM00312034.pdf/jcr:content/translations/en.DM00312034.pdf?src-supplier=Digi-Key; ComponentLink2URL: http://www.farnell.com/datasheets/2236209.pdf?src-supplier=Farnell; ComponentLink2Description: http://www.farnell.com/datasheets/2236209.pdf?src-supplier=Farnell; ComponentLink3URL: http://www.farnell.com/datasheets/2236209.pdf?src-supplier=Element14; ComponentLink3Description: http://www.farnell.com/datasheets/2236209.pdf?src-supplier=Element14; ComponentLink4URL: http://www.farnell.com/datasheets/2236209.pdf?src-supplier=Newark; ComponentLink4Description: http://www.farnell.com/datasheets/2236209.pdf?src-supplier=Newark; Supplier Part Number 1: 497-16913-1-ND
D2 = DIODE SCHOTTKY 30V 70MA SOD923: Diode Schottky 30V 70mA (DC) Surface Mount SOD-923; Manufacturer: ON Semiconductor; Forward Voltage: 350mV; Max Surge Current: 500mA; Max Power Dissipation: 100mW; Max Reverse Leakage Current: 500nA; Element Configuration: Single; Supplier 1: Digi-Key; Manufacturer Part Number: NSR0140P2T5G; Stock 1: 28802; Pricing 1: 1=0.36, 10=0.27, 25=0.2368, 100=0.1284, 500=0.1048, 1000=0.0777, 2500=0.0683 (USD); Case/Package: SOD-923-2; Number of Pins: 2; Contact Plating: Tin,Matte; Min Operating Temperature: -55°C; Max Operating Temperature: 125°C; Forward Current: 70mA; Package Quantity: 1; Packaging: Tape and Reel; Average Rectified Current: 70mA; Max Repetitive Reverse Voltage (Vrrm): 30V; Peak Reverse Current: 500nA; Power Dissipation: 100mW; Peak Non-Repetitive Surge Current: 500mA; Max Forward Surge Current (Ifsm): 500mA; Termination: SMD/SMT; Max Reverse Voltage (DC): 30V; Length: 0.85mm; Height: 0.43mm; Width: 0.65mm; Radiation Hardening: No; REACH SVHC: No SVHC; Lead Free: Lead Free; ComponentLink1URL: http://www.onsemi.com/pub_link/Collateral/NSR0140P2-D.PDF?src-supplier=Future+Electronics; ComponentLink1Description: http://www.onsemi.com/pub_link/Collateral/NSR0140P2-D.PDF?src-supplier=Future+Electronics; ComponentLink2URL: http://www.farnell.com/datasheets/2353885.pdf?src-supplier=Newark; ComponentLink2Description: http://www.farnell.com/datasheets/2353885.pdf?src-supplier=Newark; ComponentLink3URL: http://www.farnell.com/datasheets/86281.pdf?src-supplier=Element14; ComponentLink3Description: http://www.farnell.com/datasheets/86281.pdf?src-supplier=Element14; ComponentLink4URL: http://www.onsemi.com/pub/Collateral/NSR0140P2-D.PDF?src-supplier=Avnet; ComponentLink4Description: http://www.onsemi.com/pub/Collateral/NSR0140P2-D.PDF?src-supplier=Avnet; ComponentLink5URL: http://www.onsemi.com/pub/Collateral/NSR0140P2-D.PDF?src-supplier=Digi-Key; ComponentLink5Description: http://www.onsemi.com/pub/Collateral/NSR0140P2-D.PDF?src-supplier=Digi-Key; ComponentLink6URL: http://www.mouser.com/ds/2/308/NSR0140P2-D-115172.pdf?src-supplier=Mouser; ComponentLink6Description: http://www.mouser.com/ds/2/308/NSR0140P2-D-115172.pdf?src-supplier=Mouser; Supplier Part Number 1: NSR0140P2T5GOSCT-ND; ClassName: USB_SW; Mount: Surface Mount
P1 = CONN 2012670005 RCP USB3.1 TYPEC 24P SMD RA: USB-C (USB TYPE-C) USB 3.2 Gen 2 (USB 3.1 Gen 2, Superspeed + (USB 3.1)) Receptacle Connector 24 Position Surface Mount, Right Angle; Through Hole; Manufacturer: Molex; Manufacturer Part Number: 201267-0005; Number of Contacts: 24; Number of Ports: 1; Current Rating: 5A; Voltage Rating: 30V; Mating Cycles: 20000; Shielding: Shielded; Supplier 1: Digi-Key; Stock 1: 2580; Pricing 1: 1=2.34, 10=1.997, 100=1.6496 (USD); Mount: Surface Mount,Through Hole; Packaging: Tape and Reel; Connector Type: USB; Gender: Receptacle; ComponentLink1URL: https://www.molex.com/pdm_docs/sd/2012670005_sd.pdf?src-supplier=Digi-Key; ComponentLink1Description: https://www.molex.com/pdm_docs/sd/2012670005_sd.pdf?src-supplier=Digi-Key; ComponentLink2URL: http://www.farnell.com/datasheets/2722545.pdf?src-supplier=Element14; ComponentLink2Description: http://www.farnell.com/datasheets/2722545.pdf?src-supplier=Element14; Supplier Part Number 1: WM17992CT-ND; Contact Plating: Gold; Insulation Color: Black; Min Operating Temperature: -40°C; Max Operating Temperature: 105°C; Termination: Solder; Flammability Rating: UL94 V-0; ComponentLink3URL: http://www.farnell.com/datasheets/2722545.pdf?src-supplier=Newark; ComponentLink3Description: http://www.farnell.com/datasheets/2722545.pdf?src-supplier=Newark; ComponentLink4URL: https://www.molex.com/pdm_docs/pk/2012670005-PK1.pdf?src-supplier=Digi-Key; ComponentLink4Description: https://www.molex.com/pdm_docs/pk/2012670005-PK1.pdf?src-supplier=Digi-Key; ComponentLink5URL: http://www.farnell.com/datasheets/2722545.pdf?src-supplier=Farnell; ComponentLink5Description: http://www.farnell.com/datasheets/2722545.pdf?src-supplier=Farnell
Q1 = ARRAY MOSFET 2N-CH 30V 0.4A SOT-563: Mosfet Array 2 N-Channel (Dual) 30V 400mA 400mW Surface Mount SOT-563; Manufacturer: Diodes; Gate to Source Voltage (Vgs): 10V; Rds On Max: 1.2R; Input Capacitance: 39pF; Number of Channels: 2; Supplier 1: Digi-Key; Manufacturer Part Number: DMN32D2LV-7; Stock 1: 141366; Pricing 1: 1=0.39, 10=0.338, 25=0.3152, 100=0.234, 500=0.1827, 1000=0.1485 (USD); Mount: Surface Mount; Min Operating Temperature: -55°C; Max Operating Temperature: 150°C; Continuous Drain Current (ID): 400mA; Package Quantity: 3000; Packaging: Tape and Reel; Drain to Source Voltage (Vdss): 30V; Max Power Dissipation: 400mW; Drain to Source Breakdown Voltage: 30V; Drain to Source Resistance: 1.2R; Element Configuration: Dual; FET Type: 2 N-Channel; Length: 1.6mm; Height: 0.6mm; Width: 1.2mm; Radiation Hardening: No; REACH SVHC: No SVHC; ComponentLink1URL: https://www.diodes.com/assets/Datasheets/ds31121.pdf?src-supplier=Digi-Key; ComponentLink1Description: https://www.diodes.com/assets/Datasheets/ds31121.pdf?src-supplier=Digi-Key; ComponentLink2URL: http://www.mouser.com/ds/2/115/ds31121-89496.pdf?src-supplier=Mouser; ComponentLink2Description: http://www.mouser.com/ds/2/115/ds31121-89496.pdf?src-supplier=Mouser; ComponentLink3URL: http://www.diodes.com///datasheets/ds31121.pdf?src-supplier=Avnet; ComponentLink3Description: http://www.diodes.com///datasheets/ds31121.pdf?src-supplier=Avnet; Supplier Part Number 1: DMN32D2LV-7DICT-ND; Case/Package: SOT-563; Weight: 0.000106oz; Polarity: N-CHANNEL; Series: -; ClassName: TCPP
R2 R3 = RES SMD 100K OHM 1% 1/16W 0402: 100 kOhms ±1% 0.063W, 1/16W Chip Resistor 0402 (1005 Metric) Moisture Resistant Thick Film; Manufacturer: Yageo; Manufacturer Part Number: RC0402FR-07100KL; Temperature Coefficient: 100ppm/°C; Power Rating: 63mW; Voltage Rating: 50V; Supplier 1: Digi-Key; Stock 1: 47448883; Pricing 1: 1=0.1, 10=0.016, 100=0.0064, 1000=0.0029, 2500=0.0025, 5000=0.0021 (USD); Case Code (Metric): 1005; Case Code (Imperial): 0402; Min Operating Temperature: -55°C; Max Operating Temperature: 155°C; Composition: Thick Film; Packaging: Tape and Reel; Package Quantity: 1; Number of Terminations: 2; Termination: SMD/SMT; Military Standard: Not; Max Power Dissipation: 63mW; Working Voltage: 50V; Features: Moisture Resistant; Length: 0.039inch; Height: 0.016inch; Width: 0.02inch; Depth: 0.5mm; REACH SVHC: No SVHC; Lead Free: Lead Free; ComponentLink1URL: http://www.yageo.com/documents/recent/PYu-RC_Group_51_RoHS_L_10.pdf?src-supplier=Digi-Key; ComponentLink1Description: http://www.yageo.com/documents/recent/PYu-RC_Group_51_RoHS_L_10.pdf?src-supplier=Digi-Key; ComponentLink2URL: http://www.farnell.com/datasheets/1018594.pdf?src-supplier=Element14; ComponentLink2Description: http://www.farnell.com/datasheets/1018594.pdf?src-supplier=Element14; ComponentLink3URL: http://www.yageo.com/documents/recent/PYu-RC_Group_51_RoHS_L_9.pdf?src-supplier=Verical; ComponentLink3Description: http://www.yageo.com/documents/recent/PYu-RC_Group_51_RoHS_L_9.pdf?src-supplier=Verical; ComponentLink4URL: http://www.yageo.com/documents/recent/PYu-RC_Group_51_RoHS_L_9.pdf?src-supplier=Mouser; ComponentLink4Description: http://www.yageo.com/documents/recent/PYu-RC_Group_51_RoHS_L_9.pdf?src-supplier=Mouser; ComponentLink5URL: http://documents.rs-components.com/techlib://itc_doclist_GB.htm?stockno=6185797&src-supplier=RSComponents; ComponentLink5Description: http://documents.rs-components.com/techlib://itc_doclist_GB.htm?stockno=6185797&src-supplier=RSComponents; Supplier Part Number 1: 311-100KLRDKR-ND; Case/Package: 0402; ClassName: TCPP; Mount: Surface Mount
R4 R7 R10 = RES SMD NO BOM 0402: Placeholder for a 0402 resistor
  R10: ClassName: U_TS3USBCA410_USB_C_SBU_Multiplexer
R5 R8 R11 R12 = RES SMD 10K OHM 1% 1/16W 0402: 10 kOhms ±1% 0.063W, 1/16W Chip Resistor 0402 (1005 Metric) Moisture Resistant Thick Film; Manufacturer: Yageo; Manufacturer Part Number: RC0402FR-0710KP; Max Power Dissipation: 63mW; Temperature Coefficient: 150ppm/°C; Supplier 1: Digi-Key; Stock 1: 839368; Pricing 1: 1=0.1, 10=0.035, 100=0.014, 1000=0.0063, 2500=0.0055, 5000=0.0045 (USD); Case/Package: 0402; Case Code (Metric): 1005; Case Code (Imperial): 0402; Min Operating Temperature: -55°C; Max Operating Temperature: 155°C; Packaging: Tape and Reel; Composition: Thick Film; Number of Terminations: 2; Features: Moisture Resistant; Length: 0.039inch; Height: 0.016inch; Width: 0.02inch; ComponentLink1URL: http://www.yageo.com/NewPortal/yageodocoutput?fileName=/pdf/R-Chip/PYu-RC_51_RoHS_P_0.pdf&src-supplier=Digi-Key; ComponentLink1Description: http://www.yageo.com/NewPortal/yageodocoutput?fileName=/pdf/R-Chip/PYu-RC_51_RoHS_P_0.pdf&src-supplier=Digi-Key; Supplier Part Number 1: YAG1249CT-ND; Mount: Surface Mount
  R11 R12: ClassName: USB_MUX
R6 R9 R16 R17 = RES SMD 0 OHM JUMPER 1/16W 0402: as R1 on sheet Top_Control_Board_Model_C201; Supplier 1: Digi-Key; Stock 1: 46057148; Pricing 1: 1=0.1, 10=0.013, 25=0.0092, 50=0.0072, 100=0.0053, 250=0.004, 500=0.0032, 1000=0.0024, 5000=0.0017 (USD); Contact Plating: Tin,Matte; Case Code (Metric): 1005; Case Code (Imperial): 0402; Min Operating Temperature: -55°C; Max Operating Temperature: 155°C; Packaging: Tape and Reel; Composition: Thick Film; Package Quantity: 1; Number of Terminations: 2; Termination: SMD/SMT; Military Standard: Not; Features: Moisture Resistant; Length: 1mm; Height: 0.016inch; Width: 0.02inch; Depth: 0.5mm; Radiation Hardening: No; REACH SVHC: Unknown; Lead Free: Lead Free; ComponentLink1URL: http://www.yageo.com/documents/recent/PYu-RC_Group_51_RoHS_L_10.pdf?src-supplier=Digi-Key; ComponentLink1Description: http://www.yageo.com/documents/recent/PYu-RC_Group_51_RoHS_L_10.pdf?src-supplier=Digi-Key; ComponentLink2URL: http://www.yageo.com/documents/recent/PYu-RC0402_51_RoHS_L_6.pdf?src-supplier=Avnet+Europe; ComponentLink2Description: http://www.yageo.com/documents/recent/PYu-RC0402_51_RoHS_L_6.pdf?src-supplier=Avnet+Europe; ComponentLink3URL: http://www.farnell.com/datasheets/1018594.pdf?src-supplier=Element14; ComponentLink3Description: http://www.farnell.com/datasheets/1018594.pdf?src-supplier=Element14; ComponentLink4URL: https://www.verical.com/server-webapp/html/getDatasheet?partID=326379&src-supplier=Verical; ComponentLink4Description: https://www.verical.com/server-webapp/html/getDatasheet?partID=326379&src-supplier=Verical; ComponentLink5URL: http://www.farnell.com/datasheets/2167052.pdf?src-supplier=Element14; ComponentLink5Description: http://www.farnell.com/datasheets/2167052.pdf?src-supplier=Element14; Supplier Part Number 1: 311-0.0JRCT-ND; Case/Package: 0402; Mount: Surface Mount
  R9 R16: ClassName: U_TS3USBCA410_USB_C_SBU_Multiplexer
  R17: ClassName: USB_SW
R13-R15 = RES SMD 2.2 OHM 1% 1/16W 0402: 2.2 Ohms ±1% 0.063W, 1/16W Chip Resistor 0402 (1005 Metric) Moisture Resistant Thick Film; Manufacturer: Yageo; Manufacturer Part Number: RC0402FR-072R2L; Power Rating: 63mW; Voltage Rating: 50V; Temperature Coefficient: 200ppm/°C; Supplier 1: Digi-Key; Stock 1: 552576; Pricing 1: 1=0.1, 10=0.023, 100=0.0093, 1000=0.0042, 2500=0.0036, 5000=0.003 (USD); Case Code (Metric): 1005; Case Code (Imperial): 0402; Min Operating Temperature: -55°C; Max Operating Temperature: 155°C; Packaging: Tape and Reel; Composition: Thick Film; Termination: SMD/SMT; Length: 1mm; Height: 0.32mm; Width: 0.5mm; Depth: 0.5mm; REACH SVHC: No SVHC; Lead Free: Lead Free; ComponentLink1URL: http://www.farnell.com/datasheets/1018594.pdf?src-supplier=Element14; ComponentLink1Description: http://www.farnell.com/datasheets/1018594.pdf?src-supplier=Element14; ComponentLink2URL: http://www.mouser.com/ds/2/447/PYu-RC0402_51_RoHS_L_6_r-8721.pdf?src-supplier=Mouser; ComponentLink2Description: http://www.mouser.com/ds/2/447/PYu-RC0402_51_RoHS_L_6_r-8721.pdf?src-supplier=Mouser; ComponentLink3URL: http://documents.rs-components.com/techlib://itc_doclist_GB.htm?stockno=6186598&src-supplier=RSComponents; ComponentLink3Description: http://documents.rs-components.com/techlib://itc_doclist_GB.htm?stockno=6186598&src-supplier=RSComponents; ComponentLink4URL: http://www.yageo.com/documents/recent/PYu-RC0402_51_RoHS_L_6_r.pdf?src-supplier=Future+Electronics; ComponentLink4Description: http://www.yageo.com/documents/recent/PYu-RC0402_51_RoHS_L_6_r.pdf?src-supplier=Future+Electronics; Supplier Part Number 1: 311-2.20LRCT-ND; Case/Package: 0402; Number of Pins: 2; Voltage Rating (DC): 50V; ClassName: USB_SW; Mount: Surface Mount
U1 = CMC 200MA 2LN SMD ESD: 2 Line Common Mode Choke Surface Mount  200mA DCR 2.5Ohm; Manufacturer: STMicroelectronics; Number of Lines: 2; DC Resistance (DCR): 2.5R; Supplier 1: Digi-Key; Manufacturer Part Number: ECMF02-2AMX6; Stock 1: 23653; Pricing 1: 1=0.48, 10=0.418, 25=0.3888, 50=0.3288, 100=0.2989, 250=0.281, 500=0.2511, 1000=0.2033 (USD); Mount: Surface Mount; Case/Package: QFN; Number of Pins: 6; Min Operating Temperature: -40°C; Max Operating Temperature: 85°C; Packaging: Tape and Reel; Package Quantity: 1; Current: 200mA; Termination: Flat; Max Current Rating: 200mA; Current Rating: 200mA; Length: 1.75mm; Height: 0.022inch; Width: 0.059inch; Depth: 1.55mm; Radiation Hardening: No; Lead Free: Lead Free; REACH SVHC: No SVHC; ComponentLink1URL: http://www.st.com/web/en/resource/technical/document/datasheet/CD00282307.pdf?src-supplier=Future+Electronics; ComponentLink1Description: http://www.st.com/web/en/resource/technical/document/datasheet/CD00282307.pdf?src-supplier=Future+Electronics; ComponentLink2URL: http://www.st.com/content/ccc/resource/technical/document/datasheet/3a/28/cf/d0/31/63/48/8c/CD00282307.pdf/files/CD00282307.pdf/jcr:content/translations/en.CD00282307.pdf?src-supplier=Digi-Key; ComponentLink2Description: http://www.st.com/content/ccc/resource/technical/document/datasheet/3a/28/cf/d0/31/63/48/8c/CD00282307.pdf/files/CD00282307.pdf/jcr:content/translations/en.CD00282307.pdf?src-supplier=Digi-Key; ComponentLink3URL: http://www.mouser.com/ds/2/389/ecmf02-2amx6-954491.pdf?src-supplier=Mouser; ComponentLink3Description: http://www.mouser.com/ds/2/389/ecmf02-2amx6-954491.pdf?src-supplier=Mouser; ComponentLink4URL: https://www.verical.com/server-webapp/html/getDatasheet?partID=259862&src-supplier=Verical; ComponentLink4Description: https://www.verical.com/server-webapp/html/getDatasheet?partID=259862&src-supplier=Verical; Supplier Part Number 1: 497-10773-1-ND

## Sheet Test_Points.SchDoc: Test Points
size A4; DocumentNumber: 21; SheetNumber: 21; SheetTotal: 50
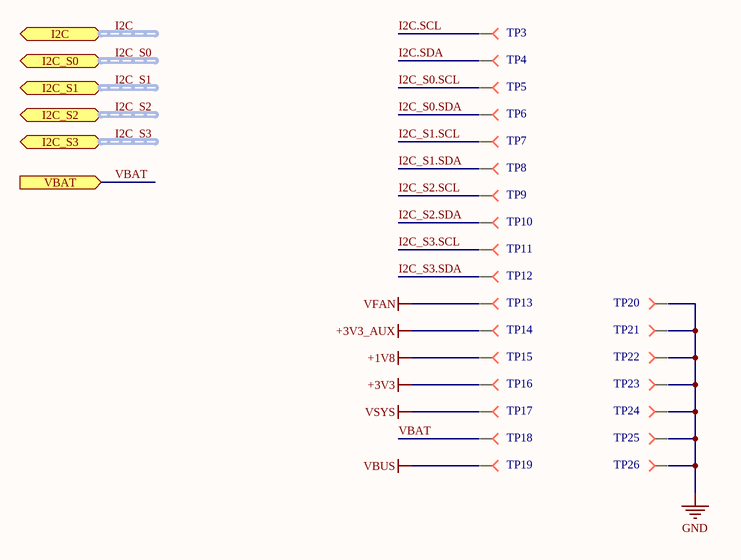
[diagram p2: Test_Points.SchDoc]

### Parts
TP3  Test Point Pad  [Testpoint]  (value not drawn)  (no BOM)
TP4  Test Point Pad  [Testpoint]  (value not drawn)  (no BOM)
TP5  Test Point Pad  [Testpoint]  (value not drawn)  (no BOM)
TP6  Test Point Pad  [Testpoint]  (value not drawn)  (no BOM)
TP7  Test Point Pad  [Testpoint]  (value not drawn)  (no BOM)
TP8  Test Point Pad  [Testpoint]  (value not drawn)  (no BOM)
TP9  Test Point Pad  [Testpoint]  (value not drawn)  (no BOM)
TP10  Test Point Pad  [Testpoint]  (value not drawn)  (no BOM)
TP11  Test Point Pad  [Testpoint]  (value not drawn)  (no BOM)
TP12  Test Point Pad  [Testpoint]  (value not drawn)  (no BOM)
TP13  Test Point Pad  [Testpoint]  (value not drawn)  (no BOM)
TP14  Test Point Pad  [Testpoint]  (value not drawn)  (no BOM)
TP15  Test Point Pad  [Testpoint]  (value not drawn)  (no BOM)
TP16  Test Point Pad  [Testpoint]  (value not drawn)  (no BOM)
TP17  Test Point Pad  [Testpoint]  (value not drawn)  (no BOM)
TP18  Test Point Pad  [Testpoint]  (value not drawn)  (no BOM)
TP19  Test Point Pad  [Testpoint]  (value not drawn)  (no BOM)
TP20  Test Point Pad  [Testpoint]  (value not drawn)  (no BOM)
TP21  Test Point Pad  [Testpoint]  (value not drawn)  (no BOM)
TP22  Test Point Pad  [Testpoint]  (value not drawn)  (no BOM)
TP23  Test Point Pad  [Testpoint]  (value not drawn)  (no BOM)
TP24  Test Point Pad  [Testpoint]  (value not drawn)  (no BOM)
TP25  Test Point Pad  [Testpoint]  (value not drawn)  (no BOM)
TP26  Test Point Pad  [Testpoint]  (value not drawn)  (no BOM)

### Ports
I2C (harness I2C), I2C_S0 (harness I2C), I2C_S1 (harness I2C), I2C_S2 (harness I2C), I2C_S3 (harness I2C), VBAT (in)

### Nets
+1V8: TP15.1
+3V3: TP16.1
+3V3_AUX: TP14.1
GND: TP20.1 TP21.1 TP22.1 TP23.1 TP24.1 TP25.1 TP26.1
VBUS: TP19.1
VFAN: TP13.1
VSYS: TP17.1
I2C.SCL: TP3.1
I2C.SDA: TP4.1
I2C_S0.SCL: TP5.1
I2C_S0.SDA: TP6.1
I2C_S1.SCL: TP7.1
I2C_S1.SDA: TP8.1
I2C_S2.SCL: TP9.1
I2C_S2.SDA: TP10.1
I2C_S3.SCL: TP11.1
I2C_S3.SDA: TP12.1
VBAT: TP18.1 ; port VBAT

### Buses and harness runs
harness I2C = port I2C
harness I2C_S0 = port I2C_S0
harness I2C_S1 = port I2C_S1
harness I2C_S2 = port I2C_S2
harness I2C_S3 = port I2C_S3

### Notes on the sheet
- Title
- Size:
- Date:
- A4
- Number:
- Time:
- Revision:
- Sheet
- of
- File:

### Library data of the parts
TP3-TP26 = Test Point Pad: Test Point. There is nothing to buy or mount.; ClassName: TestPoint; CompType: TestPoint; Manufacturer: N/A; MountType: N/A; PackageReference: TetsPoint; PartNumber: N/A